# Altium project E16-02-DCU.PrjPcb
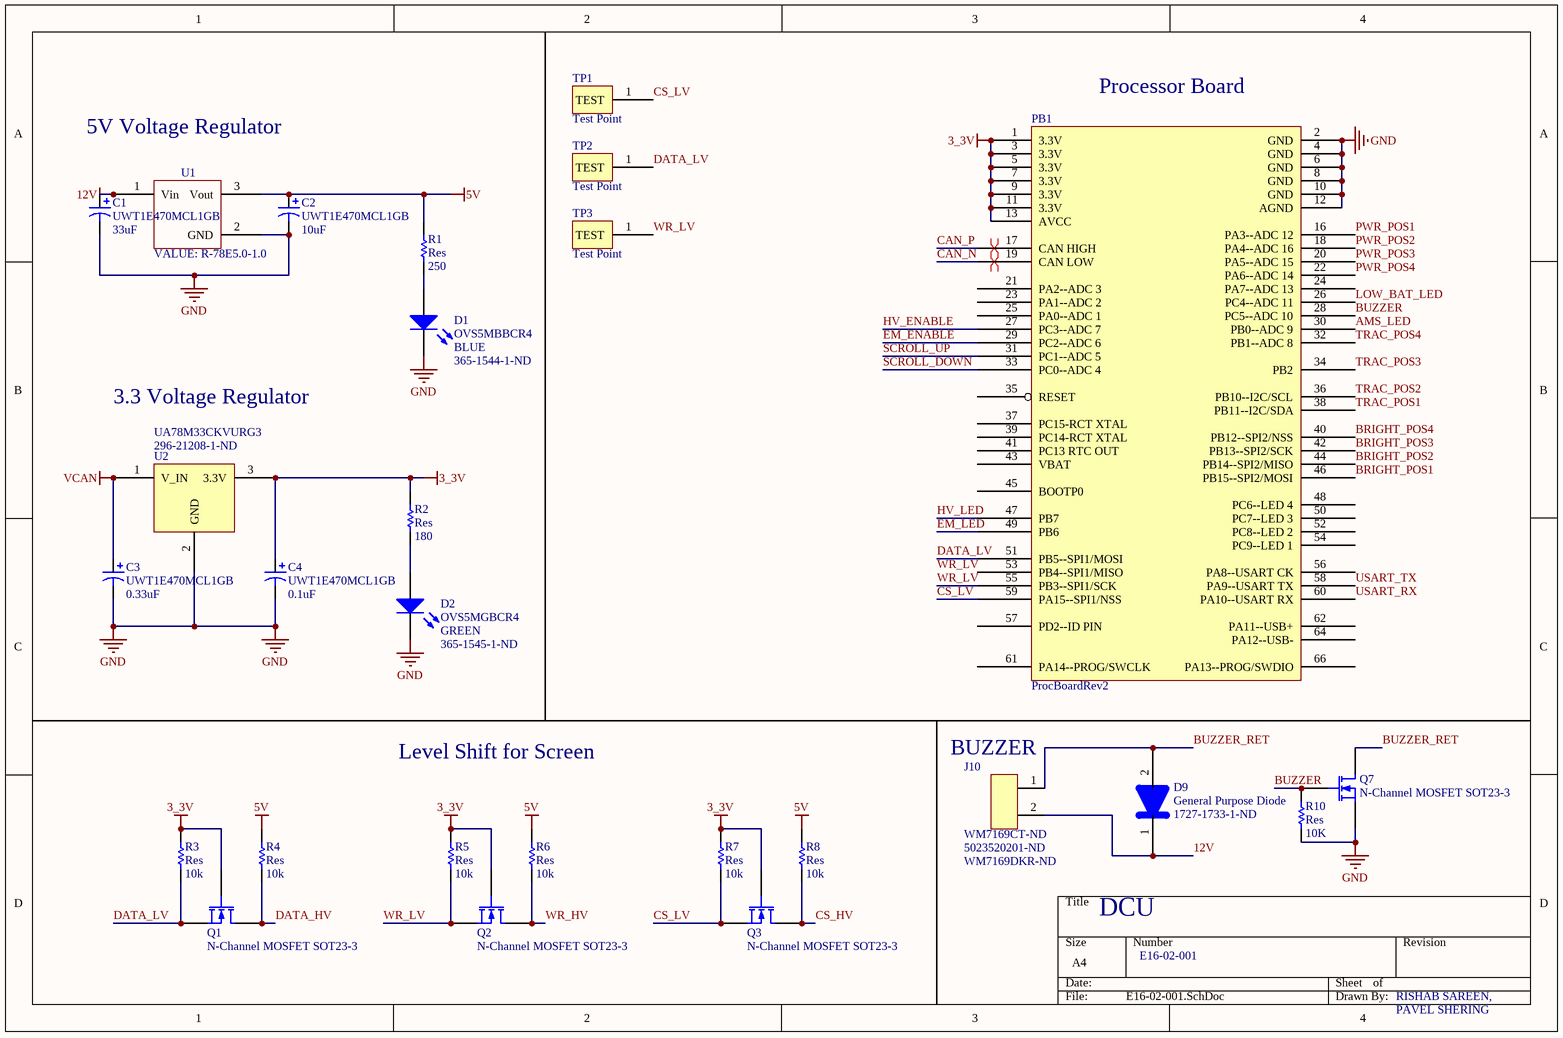
[diagram p0: E16-02-001.SchDoc]
2 sheets, 74 parts. Net scope: global (net labels, ports and power ports of the same name join across sheets).
Board files: E16-02-003.PcbDoc, E17-02-003.PcbDoc
Sheets:
  E16-02-001.SchDoc
  E16-02-002.SchDoc

## Sheet E16-02-001.SchDoc
size A4

### Parts
C1  UWT1E470MCL1GB  value 33uF  [UWT1E470MCL1GB]
C2  UWT1E470MCL1GB  value 10uF  [UWT1E470MCL1GB]
C3  UWT1E470MCL1GB  value 0.33uF  [UWT1E470MCL1GB]
C4  UWT1E470MCL1GB  value 0.1uF  [UWT1E470MCL1GB]
D1  OVS5MBBCR4  Colour: BLUE  Supplier Part Number 1: 365-1544-1-ND  [OVS5MBBCR4]
D2  OVS5MGBCR4  Colour: GREEN  Supplier Part Number 1: 365-1545-1-ND  [OVS5MGBCR4]
D9  General Purpose Diode  Digikey P/N: 1727-1733-1-ND  [SODFL350X110-2N]
J10  Supplier Part Number 1: 5023520201-ND  Supplier Part Number 2: WM7169DKR-ND  [MOLEX_DURACLIK_2]  (hidden comment: J_5023520200)
PB1  ProcBoardRev2  [PROC_BOARD]
Q1  N-Channel MOSFET SOT23-3  [SOT23-3]
Q2  N-Channel MOSFET SOT23-3  [SOT23-3]
Q3  N-Channel MOSFET SOT23-3  [SOT23-3]
Q7  N-Channel MOSFET SOT23-3  [SOT23-3]
R1  Res  value 250  [3216[1206]]
R2  Res  value 180  [3216[1206]]
R3  Res  value 10k  [3216[1206]]
R4  Res  value 10k  [3216[1206]]
R5  Res  value 10k  [3216[1206]]
R6  Res  value 10k  [3216[1206]]
R7  Res  value 10k  [3216[1206]]
R8  Res  value 10k  [3216[1206]]
R10  Res  value 10K  [3216[1206]]
TP1  Test Point  [TEST POINT 5000K]
TP2  Test Point  [TEST POINT 5000K]
TP3  Test Point  [TEST POINT 5000K]
U1  R-78E5.0-1.0  [R-78E5.0-1.0]
U2  UA78M33CKVURG3  Supplier Part Number 1: 296-21208-1-ND  [TO-252-3]

### Nets
3_3V: C4.1 PB1.1(3.3V) PB1.3(3.3V) PB1.5(3.3V) PB1.7(3.3V) PB1.9(3.3V) PB1.11(3.3V) PB1.13(AVCC) Q1.1(G) Q2.1(G) Q3.1(G) R2.2 R3.2 R5.2 R7.2 U2.3(3.3V)
5V: C2.1 R1.2 R4.2 R6.2 R8.2 U1.3(Vout)
12V: C1.1 D9.1 J10.2 U1.1(Vin)
GND: C1.2 C2.2 C3.2 C4.2 D1.2(K) D2.2(K) PB1.2(GND) PB1.4(GND) PB1.6(GND) PB1.8(GND) PB1.10(GND) PB1.12(AGND) Q7.2(S) R10.1 U1.2(GND) U2.2(GND)
VCAN: C3.1 U2.1(V_IN)
AMS_LED: PB1.30(PB0--ADC_9)
BRIGHT_POS1: PB1.46(PB15--SPI2/MOSI)
BRIGHT_POS2: PB1.44(PB14--SPI2/MISO)
BRIGHT_POS3: PB1.42(PB13--SPI2/SCK)
BRIGHT_POS4: PB1.40(PB12--SPI2/NSS)
BUZZER: PB1.28(PC5--ADC_10) Q7.1(G) R10.2
BUZZER_RET: D9.2 J10.1 Q7.3(D)
CAN_N: PB1.19(CAN_LOW)
CAN_P: PB1.17(CAN_HIGH)
CS_HV: Q3.3(D) R8.1
CS_LV: PB1.59(PA15--SPI1/NSS) Q3.2(S) R7.1 TP1.1(TEST)
DATA_HV: Q1.3(D) R4.1
DATA_LV: PB1.51(PB5--SPI1/MOSI) Q1.2(S) R3.1 TP2.1(TEST)
EM_ENABLE: PB1.29(PC2--ADC_6)
EM_LED: PB1.49(PB6)
HV_ENABLE: PB1.27(PC3--ADC_7)
HV_LED: PB1.47(PB7)
LOW_BAT_LED: PB1.26(PC4--ADC_11)
PWR_POS1: PB1.16(PA3--ADC_12)
PWR_POS2: PB1.18(PA4--ADC_16)
PWR_POS3: PB1.20(PA5--ADC_15)
PWR_POS4: PB1.22(PA6--ADC_14)
SCROLL_DOWN: PB1.33(PC0--ADC_4)
SCROLL_UP: PB1.31(PC1--ADC_5)
TRAC_POS1: PB1.38(PB11--I2C/SDA)
TRAC_POS2: PB1.36(PB10--I2C/SCL)
TRAC_POS3: PB1.34(PB2)
TRAC_POS4: PB1.32(PB1--ADC_8)
USART_RX: PB1.60(PA10--USART_RX)
USART_TX: PB1.58(PA9--USART_TX)
WR_HV: Q2.3(D) R6.1
WR_LV: PB1.55(PB3--SPI1/SCK) Q2.2(S) R5.1 TP3.1(TEST)
NetD1_1: D1.1(A) R1.1
NetD2_1: D2.1(A) R2.1

Not connected (* = marked no-connect by the designer): PB1 14(NC) 15(NC) 21(PA2--ADC_3) 23(PA1--ADC_2) 24(PA7--ADC_13) 25(PA0--ADC_1) 35(RESET) 37(PC15-RCT_XTAL) 39(PC14-RCT_XTAL) 41(PC13_RTC_OUT) 43(VBAT) 45(BOOTP0) 48(PC6--LED_4) 50(PC7--LED_3) 52(PC8--LED_2) 53(PB4--SPI1/MISO) 54(PC9--LED_1) 56(PA8--USART_CK) 57(PD2--ID_PIN) 61(PA14--PROG/SWCLK) 62(PA11--USB+) 63(NC) 64(PA12--USB-) 65(NC) 66(PA13--PROG/SWDIO) 67

### Layout directives
differential pair: CAN_N, CAN_P

### Notes on the sheet
- (near PB1) Processor Board
- 5V Voltage Regulator
- 3.3 Voltage Regulator
- Level Shift for Screen
- (near J10) BUZZER
- DCU
- E16-02-001
- RISHAB SAREEN,
- PAVEL SHERING
- Labels drawn without touching a wire or pin: WR_LV

### Library data of the parts
C1-C4 = UWT1E470MCL1GB: CAP ALUM 47UF 25V 20% SMD; Published: 8-Jun-2000; LatestRevisionDate: 17-Jul-2002; LatestRevisionNote: Re-released for DXP Platform.; PackageReference: POLAR0.8; Publisher: Altium Limited; PackageDescription: Polarized Capacitor; 2 Leads
D1 = OVS5MBBCR4: Typical BLUE LED; Published: 8-Jun-2000; LatestRevisionDate: 17-Jul-2002; LatestRevisionNote: Re-released for DXP Platform.; PackageDocument: Feb-2002; PackageReference: 3.2X1.6X1.1; Publisher: Altium Limited; Supplier 1: Digi-Key
D2 = OVS5MGBCR4: Typical GREEN LED; Published: 8-Jun-2000; LatestRevisionDate: 17-Jul-2002; LatestRevisionNote: Re-released for DXP Platform.; PackageDocument: Feb-2002; PackageReference: 3.2X1.6X1.1; Publisher: Altium Limited; Supplier 1: Digi-Key
J10 = J_5023520200: MOLEX DURACLIK 2-PIN RA; Digikey_PN: WM7169CT-ND; Supplier 1: Digi-Key; Supplier 2: Digi-Key
PB1 = ProcBoardRev2: Processor board that carries the STM32F072RB
Q1-Q3 Q7 = MOSFET-N SOT23-3
R1-R8 R10 = Res: Surface Mount Resistor; Published: 8-Jun-2000; LatestRevisionDate: 17-Jul-2002; LatestRevisionNote: Re-released for DXP Platform.; PackageReference: AXIAL-0.5; Publisher: Altium Limited
TP1-TP3 = Test Point: 5000-5004, 5015-5019 Keystone Electronics
U1 = R-78E5.0-1.0: Recom Power 28V to 5V; MFG: Recom Power; Supplier Part Number 1: 945-2201-ND; MFG_PN: R-78E5.0-1.0; Supplier 1: Digi-Key; VALUE: R-78E5.0-1.0
U2 = UA78M33CKVURG3: 3.3V Regulator; Supplier 1: Digi-Key

## Sheet E16-02-002.SchDoc
size A4
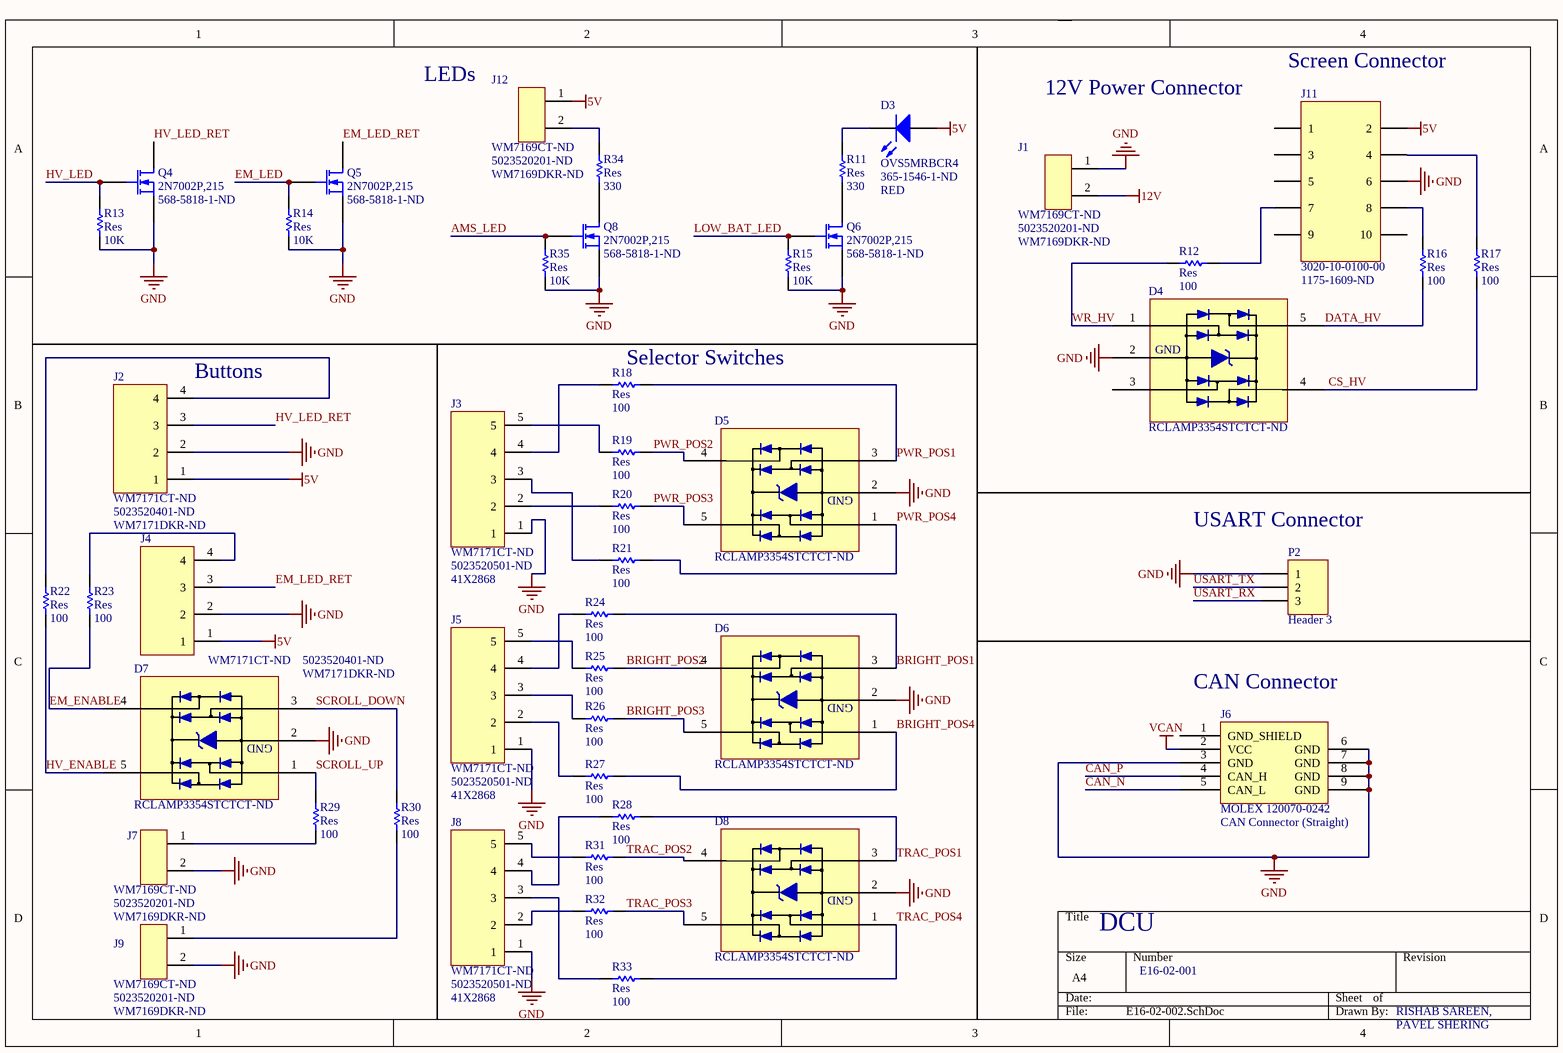
[diagram p1: E16-02-002.SchDoc]

### Parts
D3  OVS5MRBCR4  Supplier Part Number 1: 365-1546-1-ND  Colour: RED  [OVS5MRBCR4]
D4  Supplier Part Number 1: RCLAMP3354STCTCT-ND  [SOT95P280X145-5N]  (hidden comment: RCLAMP3354S.TCT)
D5  Supplier Part Number 1: RCLAMP3354STCTCT-ND  [SOT95P280X145-5N]  (hidden comment: RCLAMP3354S.TCT)
D6  Supplier Part Number 1: RCLAMP3354STCTCT-ND  [SOT95P280X145-5N]  (hidden comment: RCLAMP3354S.TCT)
D7  Supplier Part Number 1: RCLAMP3354STCTCT-ND  [SOT95P280X145-5N]  (hidden comment: RCLAMP3354S.TCT)
D8  Supplier Part Number 1: RCLAMP3354STCTCT-ND  [SOT95P280X145-5N]  (hidden comment: RCLAMP3354S.TCT)
J1  Supplier Part Number 1: 5023520201-ND  Supplier Part Number 2: WM7169DKR-ND  [MOLEX_DURACLIK_2]  (hidden comment: J_5023520200)
J2  Supplier Part Number 1: 5023520401-ND  Supplier Part Number 2: WM7171DKR-ND  [MOLEX_DURACLIK_4]  (hidden comment: WM7171CT-ND)
J3  Supplier Part Number 1: 5023520501-ND  Supplier Part Number 2: 41X2868  [MOLEX_DURACLIK_5]  (hidden comment: WM7171CT-ND)
J4  Supplier Part Number 1: 5023520401-ND  Supplier Part Number 2: WM7171DKR-ND  [MOLEX_DURACLIK_4]  (hidden comment: WM7171CT-ND)
J5  Supplier Part Number 1: 5023520501-ND  Supplier Part Number 2: 41X2868  [MOLEX_DURACLIK_5]  (hidden comment: WM7171CT-ND)
J6  CAN Connector (Straight)  [CAN Connector (Straight)]
J7  Supplier Part Number 1: 5023520201-ND  Supplier Part Number 2: WM7169DKR-ND  [MOLEX_DURACLIK_2]  (hidden comment: J_5023520200)
J8  Supplier Part Number 1: 5023520501-ND  Supplier Part Number 2: 41X2868  [MOLEX_DURACLIK_5]  (hidden comment: WM7171CT-ND)
J9  Supplier Part Number 1: 5023520201-ND  Supplier Part Number 2: WM7169DKR-ND  [MOLEX_DURACLIK_2]  (hidden comment: J_5023520200)
J11  3020-10-0100-00  Supplier Part Number 1: 1175-1609-ND  [IDC 10 Pos]
J12  Supplier Part Number 1: 5023520201-ND  Supplier Part Number 2: WM7169DKR-ND  [MOLEX_DURACLIK_2]  (hidden comment: J_5023520200)
P2  Header 3  [HDR1X3]
Q4  2N7002P,215  Supplier Part Number 1: 568-5818-1-ND  [SOT23-3]
Q5  2N7002P,215  Supplier Part Number 1: 568-5818-1-ND  [SOT23-3]
Q6  2N7002P,215  Supplier Part Number 1: 568-5818-1-ND  [SOT23-3]
Q8  2N7002P,215  Supplier Part Number 1: 568-5818-1-ND  [SOT23-3]
R11  Res  value 330  [3216[1206]]
R12  Res  value 100  [3216[1206]]
R13  Res  value 10K  [3216[1206]]
R14  Res  value 10K  [3216[1206]]
R15  Res  value 10K  [3216[1206]]
R16  Res  value 100  [3216[1206]]
R17  Res  value 100  [3216[1206]]
R18  Res  value 100  [3216[1206]]
R19  Res  value 100  [3216[1206]]
R20  Res  value 100  [3216[1206]]
R21  Res  value 100  [3216[1206]]
R22  Res  value 100  [3216[1206]]
R23  Res  value 100  [3216[1206]]
R24  Res  value 100  [3216[1206]]
R25  Res  value 100  [3216[1206]]
R26  Res  value 100  [3216[1206]]
R27  Res  value 100  [3216[1206]]
R28  Res  value 100  [3216[1206]]
R29  Res  value 100  [3216[1206]]
R30  Res  value 100  [3216[1206]]
R31  Res  value 100  [3216[1206]]
R32  Res  value 100  [3216[1206]]
R33  Res  value 100  [3216[1206]]
R34  Res  value 330  [3216[1206]]
R35  Res  value 10K  [3216[1206]]

### Nets
5V: D3.1(A) J2.1 J4.1 J11.2 J12.1
12V: J1.2
GND: D4.2(GND) D5.2(GND) D6.2(GND) D7.2(GND) D8.2(GND) J1.1 J2.2 J3.1 J4.2 J5.1 J6.3(GND) J6.6(GND) J6.7(GND) J6.8(GND) J6.9(GND) J7.2 J8.1 J9.2 J11.6 P2.1 Q4.2(S) Q5.2(S) Q6.2(S) Q8.2(S) R13.1 R14.1 R15.1 R35.1
VCAN: J6.2(VCC)
AMS_LED: Q8.1(G) R35.2
BRIGHT_POS1: D6.3 R24.1
BRIGHT_POS2: D6.4 R25.2
BRIGHT_POS3: D6.5 R26.2
BRIGHT_POS4: D6.1 R27.1
CAN_N: J6.5(CAN_L)
CAN_P: J6.4(CAN_H)
CS_HV: D4.4 R17.1
DATA_HV: D4.5 R16.1
EM_ENABLE: D7.4 R23.1
EM_LED: Q5.1(G) R14.2
EM_LED_RET: J4.3 Q5.3(D)
HV_ENABLE: D7.5 R22.1
HV_LED: Q4.1(G) R13.2
HV_LED_RET: J2.3 Q4.3(D)
LOW_BAT_LED: Q6.1(G) R15.2
PWR_POS1: D5.3 R18.1
PWR_POS2: D5.4 R19.1
PWR_POS3: D5.5 R20.2
PWR_POS4: D5.1 R21.1
SCROLL_DOWN: D7.3 R30.2
SCROLL_UP: D7.1 R29.1
TRAC_POS1: D8.3 R28.1
TRAC_POS2: D8.4 R31.2
TRAC_POS3: D8.5 R32.2
TRAC_POS4: D8.1 R33.1
USART_RX: P2.3
USART_TX: P2.2
WR_HV: D4.1 R12.1
NetD3_2: D3.2(K) R11.2
NetJ2_4: J2.4 R22.2
NetJ3_2: J3.2 R20.1
NetJ3_3: J3.3 R21.2
NetJ3_4: J3.4 R18.2
NetJ3_5: J3.5 R19.2
NetJ4_4: J4.4 R23.2
NetJ5_2: J5.2 R27.2
NetJ5_3: J5.3 R26.1
NetJ5_4: J5.4 R24.2
NetJ5_5: J5.5 R25.1
NetJ7_1: J7.1 R29.2
NetJ8_2: J8.2 R32.1
NetJ8_3: J8.3 R33.2
NetJ8_4: J8.4 R28.2
NetJ8_5: J8.5 R31.1
NetJ9_1: J9.1 R30.1
NetJ11_4: J11.4 R17.2
NetJ11_7: J11.7 R12.2
NetJ11_8: J11.8 R16.2
NetJ12_2: J12.2 R34.2
NetQ6_3: Q6.3(D) R11.1
NetQ8_3: Q8.3(D) R34.1

Not connected (* = marked no-connect by the designer): D4 3; J6 1(GND_SHIELD); J11 1 3 5 9 10

### Notes on the sheet
- LEDs
- 12V Power Connector
- Screen Connector
- (near J2) Buttons
- (near R18) Selector Switches
- (near P2) USART Connector
- (near J6) CAN Connector
- DCU
- E16-02-001
- RISHAB SAREEN,
- PAVEL SHERING
- (in symbol CAN Connector (Straight)) MOLEX 120070-0242

### Library data of the parts
D3 = OVS5MRBCR4: Typical RED LED; Published: 8-Jun-2000; LatestRevisionDate: 17-Jul-2002; LatestRevisionNote: Re-released for DXP Platform.; PackageDocument: Feb-2002; PackageReference: 3.2X1.6X1.1; Publisher: Altium Limited; Supplier 1: Digi-Key
D4-D8 = RCLAMP3354S.TCT: TVS DIODE 3.3VWM 16VC; Supplier 1: Digi-Key
J1 J7 J9 J12 = J_5023520200: MOLEX DURACLIK 2-PIN RA; Digikey_PN: WM7169CT-ND; Supplier 1: Digi-Key; Supplier 2: Digi-Key
J2 J4 = J_5023520400: MOLEX DURACLIK 4-PIN RA; Supplier 1: Digi-Key; Supplier 2: Digi-Key; Digikey_PN: WM7171CT-ND
J3 J5 J8 = J_5023520500: MOLEX DURACLIK 5-PIN RA; Supplier 1: Digi-Key; Supplier 2: Newark; Digikey_PN: WM7171CT-ND
J11 = IDC_10Pos: Supplier 1: Digi-Key
P2 = Header 3: Header, 3-Pin; LatestRevisionDate: 17-Jul-2002; LatestRevisionNote: Re-released for DXP Platform.; Publisher: Altium Limited
Q4-Q6 Q8 = 2N7002P,215: N-Channel Enhancement Mode Vertical DMOS FET; PackageReference: SOT23; PackageDescription: SOT-23; 3 Leads; Body 3.1 x 2.5 mm, inc. leads (LxW max), Alternate Lead Configuration; Supplier 1: Digi-Key
R11-R35 = Res: Surface Mount Resistor; Published: 8-Jun-2000; LatestRevisionDate: 17-Jul-2002; LatestRevisionNote: Re-released for DXP Platform.; PackageReference: AXIAL-0.5; Publisher: Altium Limited
J6 = CAN Connector (Straight): Supplier 1: Mouser

## Nets that join several sheets
5V: E16-02-001 (6 pins), E16-02-002 (5 pins)
12V: E16-02-001 (C1.1 D9.1 J10.2 U1.1), E16-02-002 (J1.2)
GND: E16-02-001 (16 pins), E16-02-002 (28 pins)
VCAN: E16-02-001 (C3.1 U2.1), E16-02-002 (J6.2)
AMS_LED: E16-02-001 (PB1.30), E16-02-002 (Q8.1 R35.2)
BRIGHT_POS1: E16-02-001 (PB1.46), E16-02-002 (D6.3 R24.1)
BRIGHT_POS2: E16-02-001 (PB1.44), E16-02-002 (D6.4 R25.2)
BRIGHT_POS3: E16-02-001 (PB1.42), E16-02-002 (D6.5 R26.2)
BRIGHT_POS4: E16-02-001 (PB1.40), E16-02-002 (D6.1 R27.1)
CAN_N: E16-02-001 (PB1.19), E16-02-002 (J6.5)
CAN_P: E16-02-001 (PB1.17), E16-02-002 (J6.4)
CS_HV: E16-02-001 (Q3.3 R8.1), E16-02-002 (D4.4 R17.1)
DATA_HV: E16-02-001 (Q1.3 R4.1), E16-02-002 (D4.5 R16.1)
EM_ENABLE: E16-02-001 (PB1.29), E16-02-002 (D7.4 R23.1)
EM_LED: E16-02-001 (PB1.49), E16-02-002 (Q5.1 R14.2)
HV_ENABLE: E16-02-001 (PB1.27), E16-02-002 (D7.5 R22.1)
HV_LED: E16-02-001 (PB1.47), E16-02-002 (Q4.1 R13.2)
LOW_BAT_LED: E16-02-001 (PB1.26), E16-02-002 (Q6.1 R15.2)
PWR_POS1: E16-02-001 (PB1.16), E16-02-002 (D5.3 R18.1)
PWR_POS2: E16-02-001 (PB1.18), E16-02-002 (D5.4 R19.1)
PWR_POS3: E16-02-001 (PB1.20), E16-02-002 (D5.5 R20.2)
PWR_POS4: E16-02-001 (PB1.22), E16-02-002 (D5.1 R21.1)
SCROLL_DOWN: E16-02-001 (PB1.33), E16-02-002 (D7.3 R30.2)
SCROLL_UP: E16-02-001 (PB1.31), E16-02-002 (D7.1 R29.1)
TRAC_POS1: E16-02-001 (PB1.38), E16-02-002 (D8.3 R28.1)
TRAC_POS2: E16-02-001 (PB1.36), E16-02-002 (D8.4 R31.2)
TRAC_POS3: E16-02-001 (PB1.34), E16-02-002 (D8.5 R32.2)
TRAC_POS4: E16-02-001 (PB1.32), E16-02-002 (D8.1 R33.1)
USART_RX: E16-02-001 (PB1.60), E16-02-002 (P2.3)
USART_TX: E16-02-001 (PB1.58), E16-02-002 (P2.2)
WR_HV: E16-02-001 (Q2.3 R6.1), E16-02-002 (D4.1 R12.1)